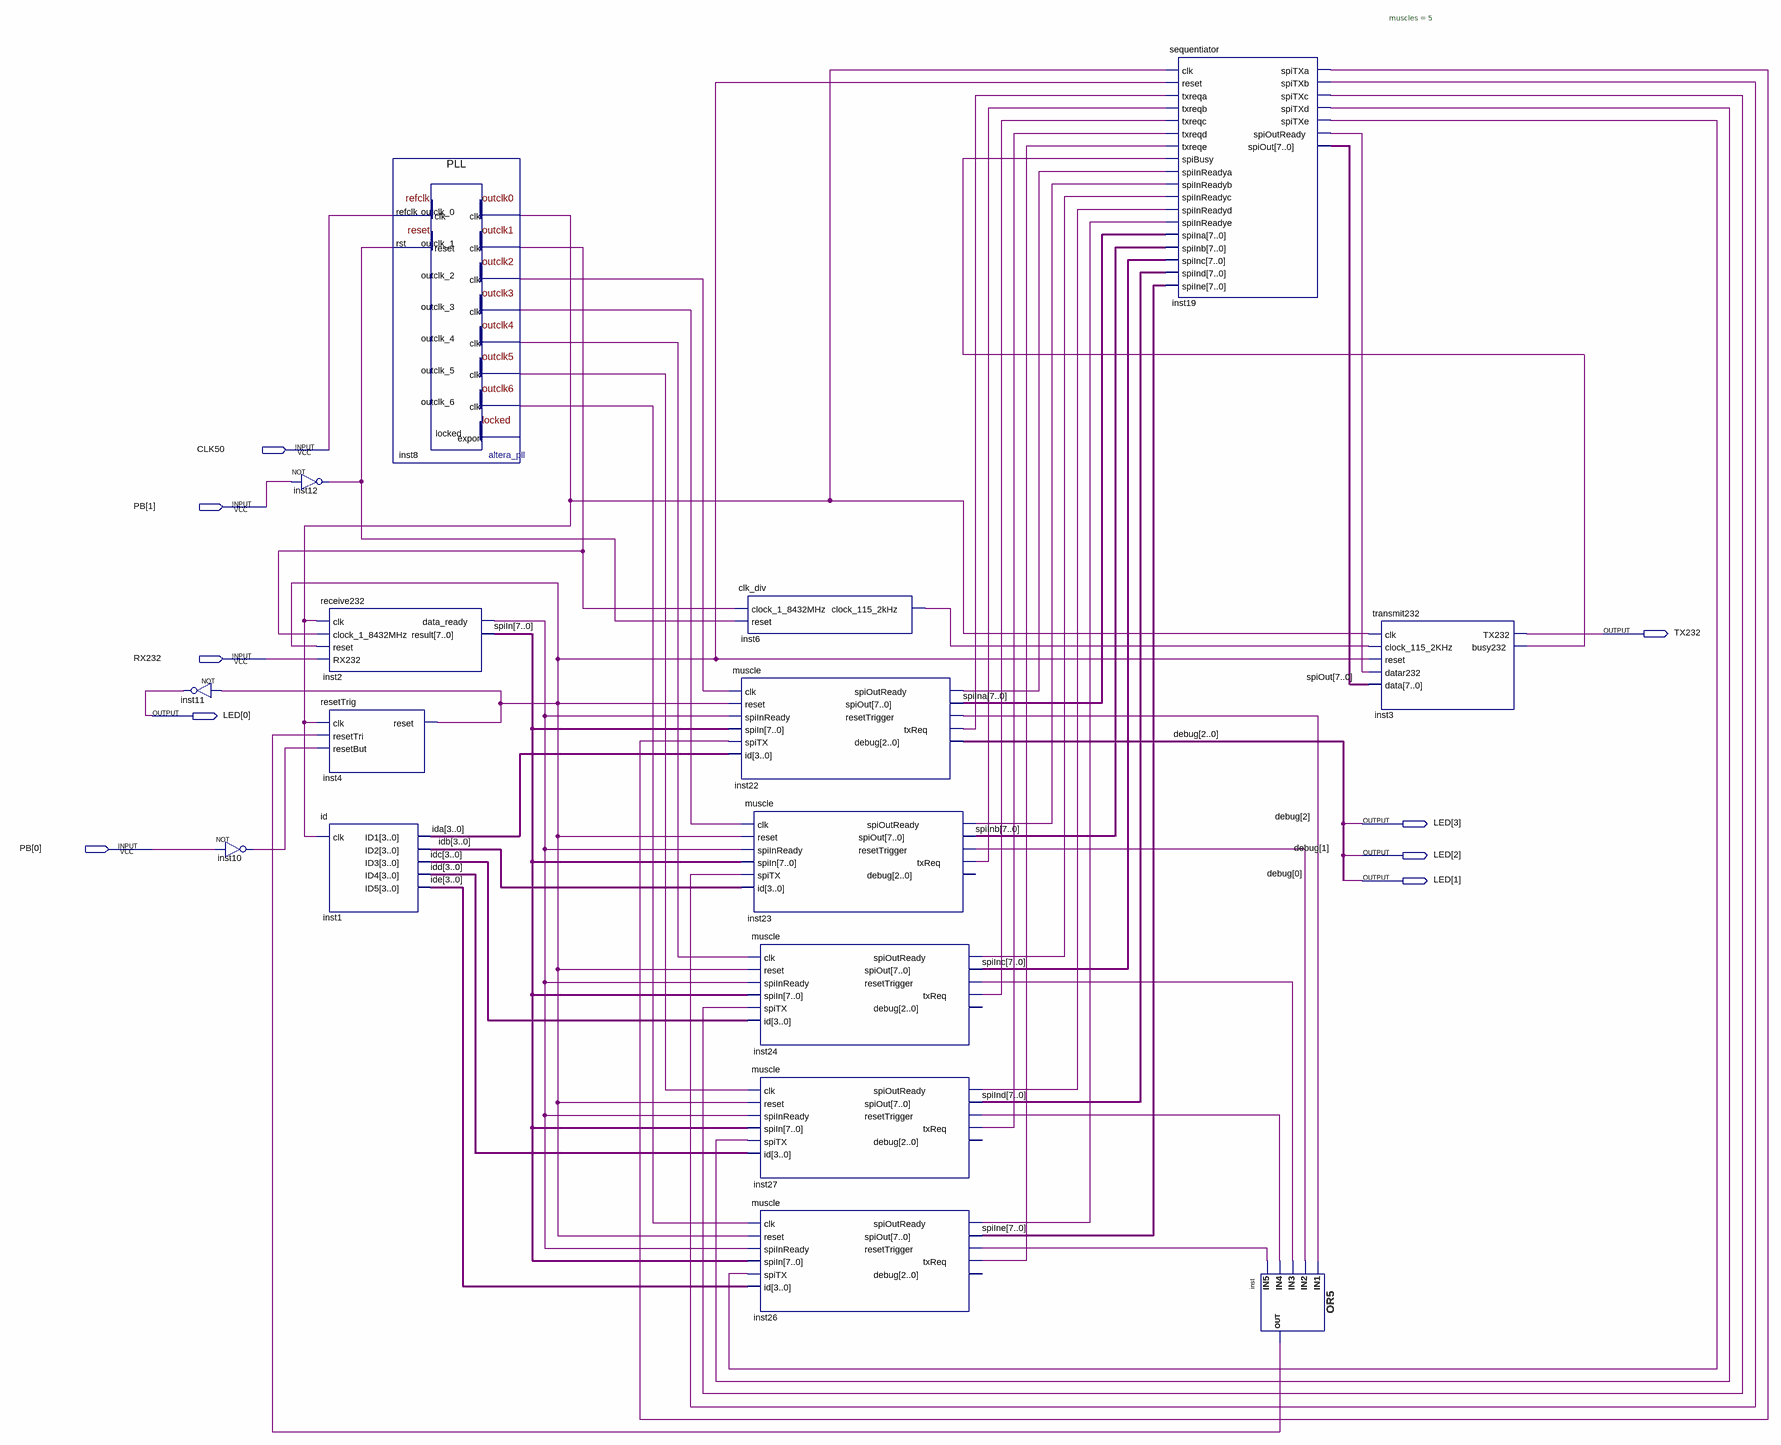
[diagram p0: schematic sheet]
// Quartus schematic HMN.bdf as structural Verilog: 16 symbols, 9 pins
module HMN (
  input  CLK50,
  input  [1:0] PB,
  input  RX232,
  output TX232,
  output [3:0] LED
);

  wire inst2_data_ready, inst3_busy232, inst4_reset, inst6_clock_115_2khz, inst8_outclk_0, inst8_outclk_1,
       inst8_outclk_2, inst8_outclk_3, inst8_outclk_4, inst8_outclk_5, inst8_outclk_6, inst10_out,
       inst12_out, inst19_spioutready, inst19_spitxa, inst19_spitxb, inst19_spitxc, inst19_spitxd,
       inst19_spitxe, inst22_resettrigger, inst22_spioutready, inst22_txreq, inst23_resettrigger,
       inst23_spioutready, inst23_txreq, inst24_resettrigger, inst24_spioutready, inst24_txreq,
       inst26_resettrigger, inst26_spioutready, inst26_txreq, inst27_resettrigger, inst27_spioutready,
       inst27_txreq, inst_out;
  wire [3:0] ida, idb, idc, idd, ide;
  wire [7:0] spiIn, spiIna, spiInb, spiInc, spiInd, spiIne, spiOut;

  not inst11 (LED[0], inst4_reset);
  not inst10 (inst10_out, PB[0]);
  not inst12 (inst12_out, PB[1]);
  receive232 inst2 (
    .clk(inst8_outclk_0), .clock_1_8432MHz(inst8_outclk_1), .reset(inst4_reset), .RX232(RX232),
    .data_ready(inst2_data_ready), .result(spiIn));
  resetTrig inst4 (.clk(inst8_outclk_0), .resetTri(inst_out), .resetBut(inst10_out), .reset(inst4_reset));
  id inst1 (.clk(inst8_outclk_0), .ID1(ida), .ID2(idb), .ID3(idc), .ID4(idd), .ID5(ide));
  PLL inst8 (
    .refclk(CLK50), .rst(inst12_out), .outclk_0(inst8_outclk_0), .outclk_1(inst8_outclk_1),
    .outclk_2(inst8_outclk_2), .outclk_3(inst8_outclk_3), .outclk_4(inst8_outclk_4),
    .outclk_5(inst8_outclk_5), .outclk_6(inst8_outclk_6));  // open: locked
  clk_div inst6 (.clock_1_8432MHz(inst8_outclk_1), .reset(inst12_out), .clock_115_2kHz(inst6_clock_115_2khz));
  muscle inst22 (
    .clk(inst8_outclk_2), .reset(inst4_reset), .spiInReady(inst2_data_ready), .spiIn(spiIn),
    .spiTX(inst19_spitxa), .id(ida), .spiOutReady(inst22_spioutready), .spiOut(spiIna),
    .resetTrigger(inst22_resettrigger), .txReq(inst22_txreq), .debug(LED[3:1]));
  muscle inst23 (
    .clk(inst8_outclk_3), .reset(inst4_reset), .spiInReady(inst2_data_ready), .spiIn(spiIn),
    .spiTX(inst19_spitxb), .id(idb), .spiOutReady(inst23_spioutready), .spiOut(spiInb),
    .resetTrigger(inst23_resettrigger), .txReq(inst23_txreq));  // open: debug
  muscle inst24 (
    .clk(inst8_outclk_4), .reset(inst4_reset), .spiInReady(inst2_data_ready), .spiIn(spiIn),
    .spiTX(inst19_spitxc), .id(idc), .spiOutReady(inst24_spioutready), .spiOut(spiInc),
    .resetTrigger(inst24_resettrigger), .txReq(inst24_txreq));  // open: debug
  muscle inst27 (
    .clk(inst8_outclk_5), .reset(inst4_reset), .spiInReady(inst2_data_ready), .spiIn(spiIn),
    .spiTX(inst19_spitxd), .id(idd), .spiOutReady(inst27_spioutready), .spiOut(spiInd),
    .resetTrigger(inst27_resettrigger), .txReq(inst27_txreq));  // open: debug
  muscle inst26 (
    .clk(inst8_outclk_6), .reset(inst4_reset), .spiInReady(inst2_data_ready), .spiIn(spiIn),
    .spiTX(inst19_spitxe), .id(ide), .spiOutReady(inst26_spioutready), .spiOut(spiIne),
    .resetTrigger(inst26_resettrigger), .txReq(inst26_txreq));  // open: debug
  sequentiator #(.muscles(5)) inst19 (
    .clk(inst8_outclk_0), .reset(inst4_reset), .txreqa(inst22_txreq), .txreqb(inst23_txreq),
    .txreqc(inst24_txreq), .txreqd(inst27_txreq), .txreqe(inst26_txreq), .spiBusy(inst3_busy232),
    .spiInReadya(inst22_spioutready), .spiInReadyb(inst23_spioutready), .spiInReadyc(inst24_spioutready),
    .spiInReadyd(inst27_spioutready), .spiInReadye(inst26_spioutready), .spiIna(spiIna), .spiInb(spiInb),
    .spiInc(spiInc), .spiInd(spiInd), .spiIne(spiIne), .spiTXa(inst19_spitxa), .spiTXb(inst19_spitxb),
    .spiTXc(inst19_spitxc), .spiTXd(inst19_spitxd), .spiTXe(inst19_spitxe), .spiOutReady(inst19_spioutready),
    .spiOut(spiOut));
  or inst (inst_out, inst22_resettrigger, inst23_resettrigger, inst24_resettrigger, inst27_resettrigger, inst26_resettrigger);
  transmit232 inst3 (
    .clk(inst8_outclk_0), .clock_115_2KHz(inst6_clock_115_2khz), .reset(inst4_reset),
    .datar232(inst19_spioutready), .data(spiOut), .TX232(TX232), .busy232(inst3_busy232));

  // Other names for the same wires on the sheet: debug[2:0] = LED[3:1]
endmodule
